# Altium project 3.NEMA_RIIM.PrjPcb
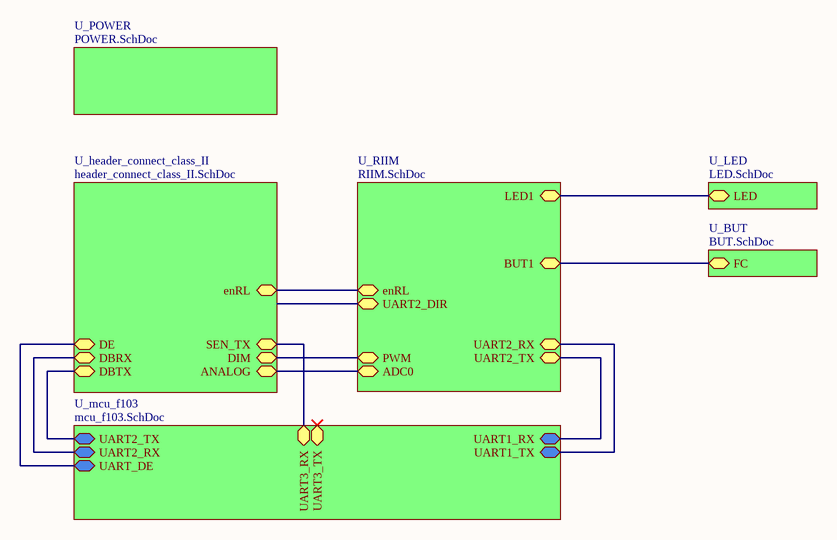
[diagram p0: Diagram.SchDoc]
6 sheets, 38 parts. Net scope: hierarchical (ports join the sheet entries above them; power ports are global).
Board file: NEMA_RIIM.PcbDoc
Sheets:
  Diagram.SchDoc
    U_BUT = BUT.SchDoc
    U_header_connect_class_II = header_connect_class_II.SchDoc
    U_LED = LED.SchDoc
    U_POWER = POWER.SchDoc
    U_RIIM = RIIM.SchDoc

## Sheet Diagram.SchDoc
size A4; SheetNumber: 1; SheetTotal: 7

### Sub-sheets
U_BUT = BUT.SchDoc: FC (bidir)
U_header_connect_class_II = header_connect_class_II.SchDoc: SEN_TX (bidir), DE (bidir), DBRX (bidir), DBTX (bidir), ANALOG (bidir), DIM (bidir), enRL (bidir)
U_LED = LED.SchDoc: LED (bidir)
U_mcu_f103 = mcu_f103.SchDoc (file not in this document): UART2_TX (bidir), UART2_RX (bidir), UART1_RX (bidir), UART1_TX (bidir), UART_DE (bidir), UART3_TX (bidir), UART3_RX (bidir)
U_POWER = POWER.SchDoc: no entries
U_RIIM = RIIM.SchDoc: LED1 (bidir), BUT1 (bidir), PWM (bidir), UART2_TX (bidir), UART2_RX (bidir), UART2_DIR (bidir), ADC0 (bidir), enRL (bidir)

### Nets
ADC0: sheet U_header_connect_class_II/ANALOG, sheet U_RIIM/ADC0
BUT1: sheet U_BUT/FC, sheet U_RIIM/BUT1
DBRX: sheet U_header_connect_class_II/DBRX, sheet U_mcu_f103/UART2_RX
DBTX: sheet U_header_connect_class_II/DBTX, sheet U_mcu_f103/UART2_TX
DE: sheet U_header_connect_class_II/DE, sheet U_mcu_f103/UART_DE
DIM: sheet U_header_connect_class_II/DIM, sheet U_RIIM/PWM
enRL: sheet U_header_connect_class_II/enRL, sheet U_RIIM/enRL
LED: sheet U_LED/LED, sheet U_RIIM/LED1
SEN_TX: sheet U_header_connect_class_II/SEN_TX, sheet U_mcu_f103/UART3_RX
UART2_RX: sheet U_RIIM/UART2_RX, sheet U_mcu_f103/UART1_TX
UART2_TX: sheet U_RIIM/UART2_TX, sheet U_mcu_f103/UART1_RX

## Sheet BUT.SchDoc
size A; SheetNumber: 6; SheetTotal: 6
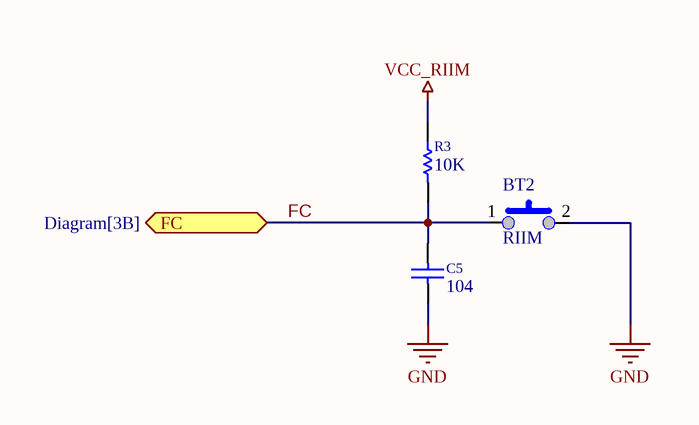
[diagram p1: BUT.SchDoc]

### Parts
BT2  RIIM  [B3U-1000P]
C5  104  [C2012-0805]
R3  10K  [R2012-0805]

### Ports
FC (bidir, see Diagram[3B])

### Nets
GND: BT2.2 C5.2
VCC_RIIM: R3.1
FC: BT2.1 C5.1 R3.2 ; port FC  [project net BUT1]

### Library data of the parts
BT2 = Button_2p
C5 = Cap <SMD>: Capacitor; AEMS Code: 2100341; Vendor: Digikey; Volt: 16V; Published: 13-April-2009; Publisher: Hoang Nguyen; ComponentLink1Description: Digikey Part Link; ComponentLink2Description: Open Datasheet; ComponentLink2URL: H:\LIBRARY\LIBRARY.Datasheet\; Value: 104
R3 = Resistor <SMD>: Resistor; AEMS Code: 1200430; Vendor: Digikey; Tollerance: 5%; Published: 17-3-2009; Publisher: Hoang Nguyen; ComponentLink1Description: Digikey Part Link; ComponentLink2Description: Open Datasheet; ComponentLink2URL: H:\LIBRARY\LIBRARY.Datasheet\; Value: 10K

## Sheet header_connect_class_II.SchDoc
size A4; SheetNumber: 2; SheetTotal: 6
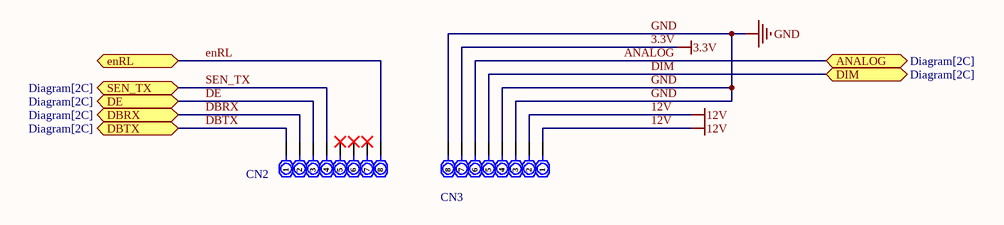
[diagram p2: header_connect_class_II.SchDoc]

### Parts
CN2  LEFT  [CON.HDR1X8]  (value not drawn)
CN3  RIGHT  [CON.HDR1X8]  (value not drawn)

### Ports
ANALOG (bidir, see Diagram[2C]), DBRX (bidir, see Diagram[2C]), DBTX (bidir, see Diagram[2C]), DE (bidir, see Diagram[2C]), DIM (bidir, see Diagram[2C]), enRL (bidir), SEN_TX (bidir, see Diagram[2C])

### Nets
3.3V: CN3.7
12V: CN3.1 CN3.2
GND: CN3.3 CN3.4 CN3.8
ANALOG: CN3.6 ; port ANALOG  [project net ADC0]
DBRX: CN2.2 ; port DBRX
DBTX: CN2.1 ; port DBTX
DE: CN2.3 ; port DE
DIM: CN3.5 ; port DIM
enRL: CN2.8 ; port enRL
SEN_TX: CN2.4 ; port SEN_TX

Not connected (* = marked no-connect by the designer): CN2 5* 6* 7*

### Library data of the parts
CN2 CN3 = CON.HDR1x8: Header 1x5; Publisher: Hoang Nguyen; ComponentLink1Description: Digikey Part link; ComponentLink2Description: Open DataSheet; ComponentLink2URL: H:\LIBRARY\LIBRARY.Datasheet\

## Sheet LED.SchDoc
size A4; SheetNumber: 2; SheetTotal: 4
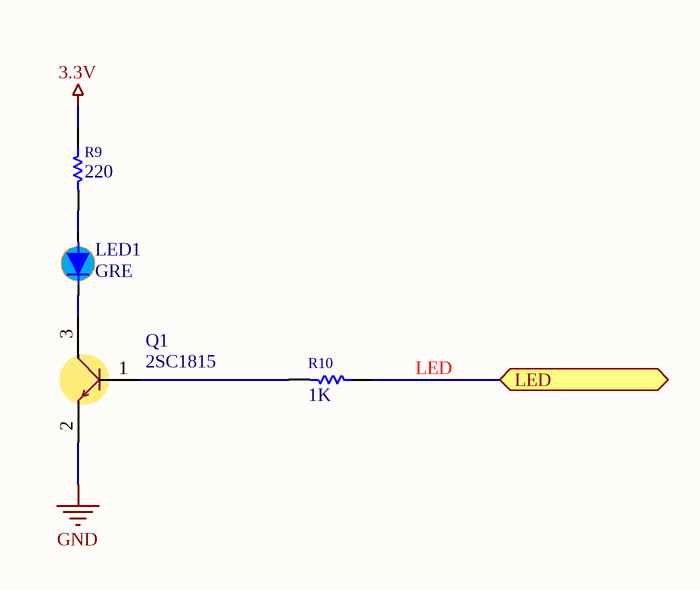
[diagram p3: LED.SchDoc]

### Parts
LED1  GRE  [Led 3mm_D]
Q1  2SC1815  [SOT23]
R9  220  [R2012-0805]
R10  1K  [R2012-0805]

### Ports
LED (bidir)

### Nets
3.3V: R9.1
GND: Q1.2(E)
LED: R10.1 ; port LED
NetLED1_1: LED1.1(A) R9.2
NetLED1_2: LED1.2(K) Q1.3(C)
NetQ1_1: Q1.1(B) R10.2

### Library data of the parts
LED1 = Led
Q1 = NPN_SMD: SMD TRANSISTOR
R9 R10 = Resistor <SMD>: as R3 on sheet BUT; Published: 17-3-2009; Publisher: Hoang Nguyen; ComponentLink1Description: Digikey Part Link; ComponentLink2Description: Open Datasheet; ComponentLink2URL: H:\LIBRARY\LIBRARY.Datasheet\
  R9: Value: 220
  R10: Value: 1K

## Sheet POWER.SchDoc
size A4; SheetNumber: 3; SheetTotal: 5
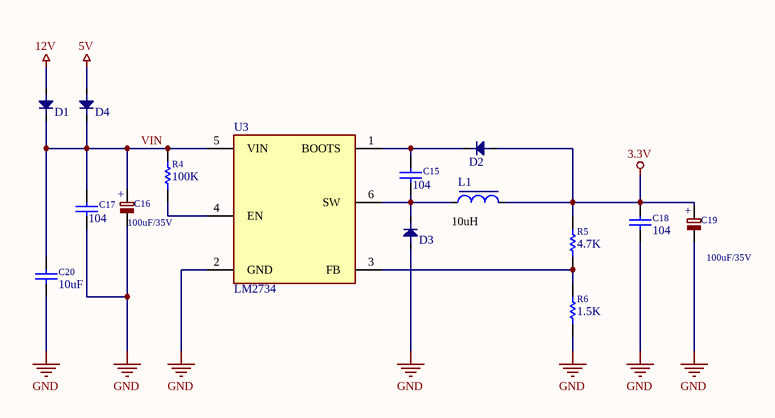
[diagram p4: POWER.SchDoc]

### Parts
C15  104  [C2012-0805]
C16  100uF/35V  [CAP_100/35V]
C17  104  [C2012-0805]
C18  104  [C2012-0805]
C19  100uF/35V  [CAP_100/35V]
C20  10uF  [C1210]
D1  SS34  [DO-214AC,SMA]  (value not drawn)
D2  SS34  [DO-214AC,SMA]  (value not drawn)
D3  SS34  [DO-214AC,SMA]  (value not drawn)
D4  SS34  [DO-214AC,SMA]  (value not drawn)
L1  10uH  [L-6030]
R4  value 100K  [R2012-0805]  (hidden comment: 4.7K)
R5  4.7K  [R2012-0805]
R6  1.5K  [R2012-0805]
U3  LM2734  [SOT23-6]

### Nets
3.3V: C18.1 C19.1(+) D2.1(A) L1.2 R5.2
5V: D4.1(A)
12V: D1.1(A)
GND: C16.2(-) C17.2 C18.2 C19.2(-) C20.2 D3.1(A) R6.1 U3.2(GND)
VIN: C16.1(+) C17.1 C20.1 D1.2(K) D4.2(K) R4.2 U3.5(VIN)
NetC15_1: C15.1 D2.2(K) U3.1(BOOTS)
NetC15_2: C15.2 D3.2(K) L1.1 U3.6(SW)
NetR4_1: R4.1 U3.4(EN)
NetR5_1: R5.1 R6.2 U3.3(FB)

### Library data of the parts
C15 C17 C18 C20 = Cap <SMD>: as C5 on sheet BUT; Published: 13-April-2009; Publisher: Hoang Nguyen; ComponentLink1Description: Digikey Part Link; ComponentLink2Description: Open Datasheet; ComponentLink2URL: H:\LIBRARY\LIBRARY.Datasheet\
  C15 C17 C18: Value: 104
  C20: Value: 10uF
C16 C19 = Cap_Pol <DIP>: Polarized Capacitor; Manufacturer: FARNELL; AEMS Code: 2100110; Vendor: Digikey; Capacitor Type: Cap Pol Dip; Published: 13-April-2009; Publisher: Hoang Nguyen; ComponentLink1Description: Digikey Part Link; ComponentLink2Description: Open Datasheet; ComponentLink2URL: H:\LIBRARY\LIBRARY.Datasheet\
D1-D4 = Didode_Smd: Vendor: Digikey; Value: FR307; Current: 3Amp; Published: 8-Jun-2000; LatestRevisionDate: 17-Jul-2002; LatestRevisionNote: Re-released for DXP Platform.; DatasheetDocument: 1997; PackageReference: DO-35; Publisher: Altium Limited; Code_JEDEC: DO-204-AH; ComponentLink1Description: Digikey Part Link; ComponentLink1URL: http://www.fairchildsemi.com/; ComponentLink2Description: Open Datasheet; ComponentLink2URL: H:\LIBRARY\LIBRARY.Datasheet\ds26003.pdf
L1 = Inductor Ferrite: Smd Inductors; Code_IEC: 1005; Vendor: Digikey; Published: 8-Jun-2000; LatestRevisionDate: 17-Jul-2002; LatestRevisionNote: Re-released for DXP Platform.; PackageReference: 0402-A; Publisher: Altium Limited; Code_JEITA: 0402; ComponentLink1Description: Digikey Part Link; ComponentLink2Description: Open Datasheet; ComponentLink2URL: H:\LIBRARY\LIBRARY.Datasheet\; Value: 10uH
R4-R6 = Resistor <SMD>: as R3 on sheet BUT; Published: 17-3-2009; Publisher: Hoang Nguyen; ComponentLink1Description: Digikey Part Link; ComponentLink2Description: Open Datasheet; ComponentLink2URL: H:\LIBRARY\LIBRARY.Datasheet\
  R5: Value: 4.7K
  R6: Value: 1.5K
U3 = LM2734: Step-Down DC-DC Regulator

## Sheet RIIM.SchDoc
size A4; SheetNumber: 5; SheetTotal: 7
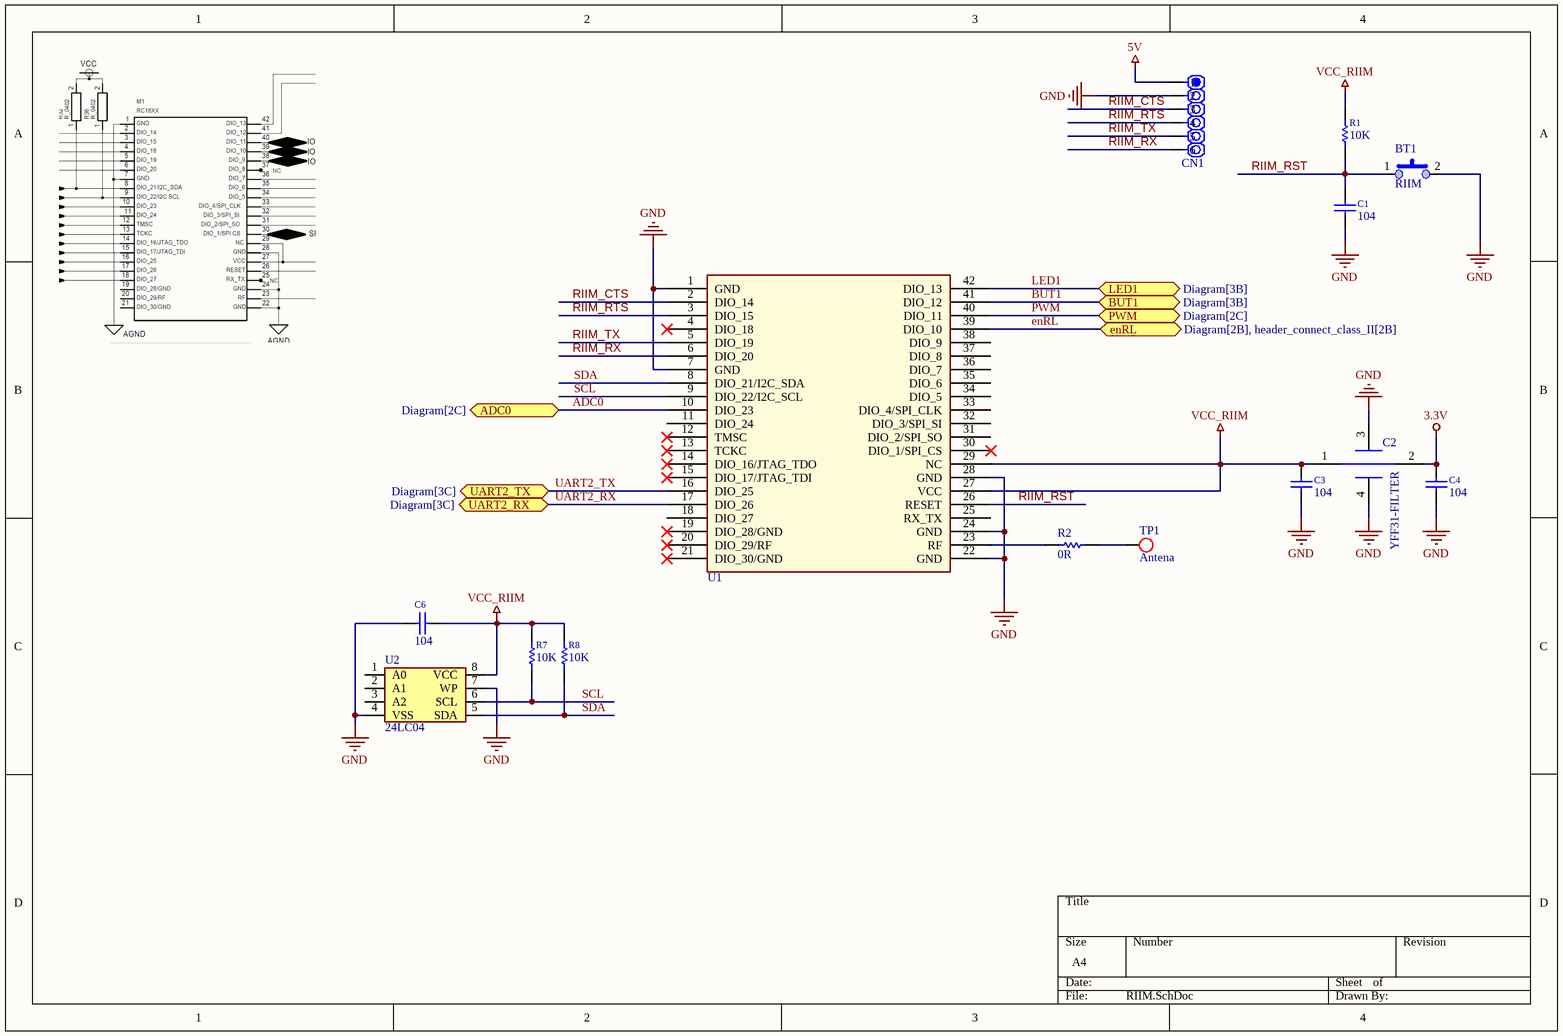
[diagram p5: RIIM.SchDoc]

### Parts
BT1  RIIM  [B3U-1000P]
C1  104  [C2012-0805]
C2  YFF31-FILTER  [YFF31PC]
C3  104  [C2012-0805]
C4  104  [C2012-0805]
C6  104  [C2012-0805]
CN1  RIIM  [CON.HD1X6H]  (value not drawn)
R1  10K  [R2012-0805]
R2  0R  [R2012-0805]
R7  10K  [R2012-0805]
R8  10K  [R2012-0805]
TP1  Antena  [TPoint]
U1  RIIM_RC_1882  [RIIM_RC1882]  (value not drawn)
U2  24LC04  [SOIC8]

### Ports
ADC0 (bidir, see Diagram[2C]), BUT1 (bidir, see Diagram[3B]), enRL (bidir, see Diagram[2B], header_connect_class_II[2B]), LED1 (bidir, see Diagram[3B]), PWM (bidir, see Diagram[2C]), UART2_RX (bidir, see Diagram[3C]), UART2_TX (bidir, see Diagram[3C])

### Nets
3.3V: C2.2(IN/OUT) C4.1
5V: CN1.1
GND: BT1.2 C1.2 C2.3(GND) C2.4(GND) C3.2 C4.2 C6.1 CN1.2 U1.1(GND) U1.7(GND) U1.22(GND) U1.24(GND) U1.28(GND) U2.4(VSS) U2.7(WP)
VCC_RIIM: C2.1(IN/OUT) C3.1 C6.2 R1.1 R7.1 R8.1 U1.27(VCC) U1.29(NC) U2.8(VCC)
ADC0: U1.10(DIO_23) ; port ADC0
BUT1: U1.41(DIO_12) ; port BUT1
enRL: U1.39(DIO_10) ; port enRL
LED1: U1.42(DIO_13) ; port LED1  [project net LED]
PWM: U1.40(DIO_11) ; port PWM  [project net DIM]
RIIM_CTS: CN1.3 U1.2(DIO_14)
RIIM_RST: BT1.1 C1.1 R1.2 U1.26(RESET)
RIIM_RTS: CN1.4 U1.3(DIO_15)
RIIM_RX: CN1.6 U1.6(DIO_20)
RIIM_TX: CN1.5 U1.5(DIO_19)
SCL: R7.2 U1.9(DIO_22/I2C_SCL) U2.6(SCL)
SDA: R8.2 U1.8(DIO_21/I2C_SDA) U2.5(SDA)
UART2_RX: U1.17(DIO_26) ; port UART2_RX
UART2_TX: U1.16(DIO_25) ; port UART2_TX
NetR2_1: R2.1 TP1.1
NetR2_2: R2.2 U1.23(RF)

Not connected (* = marked no-connect by the designer): U1 4(DIO_18)* 11(DIO_24) 12(TMSC)* 13(TCKC)* 14(DIO_16/JTAG_TDO)* 15(DIO_17/JTAG_TDI)* 18(DIO_27) 19(DIO_28/GND)* 20(DIO_29/RF)* 21(DIO_30/GND)* 25(RX_TX) 30(DIO_1/SPI_CS)* 31(DIO_2/SPI_SO) 32(DIO_3/SPI_SI) 33(DIO_4/SPI_CLK) 34(DIO_5) 35(DIO_6) 36(DIO_7) 37(DIO_8) 38(DIO_9); U2 1(A0) 2(A1) 3(A2)

### Library data of the parts
BT1 = Button_2p
C1 C3 C4 C6 = Cap <SMD>: as C5 on sheet BUT; Published: 13-April-2009; Publisher: Hoang Nguyen; ComponentLink1Description: Digikey Part Link; ComponentLink2Description: Open Datasheet; ComponentLink2URL: H:\LIBRARY\LIBRARY.Datasheet\; Value: 104
CN1 = CON.HDR1x6: Header 1x5; Publisher: Hoang Nguyen; ComponentLink1Description: Digikey Part link; ComponentLink2Description: Open DataSheet; ComponentLink2URL: H:\LIBRARY\LIBRARY.Datasheet\
R1 R7 R8 = Resistor <SMD>: as R3 on sheet BUT; Published: 17-3-2009; Publisher: Hoang Nguyen; ComponentLink1Description: Digikey Part Link; ComponentLink2Description: Open Datasheet; ComponentLink2URL: H:\LIBRARY\LIBRARY.Datasheet\; Value: 10K
R2 = RES 1/4
TP1 = TestPoint
U1 = RIIM_RC_1882: Manufacturer: Radiocrafts; Manufacturer Part Number: RC1882HPCF-IPM; Supplier 1: Digi-Key; RoHS: No; Stock 1: 842; Pricing 1: 1=24.69000, 10=22.78800, 25=20.88880, 100=19.30650, 250=18.99000 (USD); Supplier Part Number 1: 1783-RC1882HPCF-IPMCT-ND
U2 = 24LC512

## Nets that join several sheets
3.3V: header_connect_class_II (CN3.7), LED (R9.1), POWER (5 pins), RIIM (C2.2 C4.1)
5V: POWER (D4.1), RIIM (CN1.1)
12V: header_connect_class_II (CN3.1 CN3.2), POWER (D1.1)
GND: BUT (BT2.2 C5.2), header_connect_class_II (CN3.3 CN3.4 CN3.8), LED (Q1.2), POWER (8 pins), RIIM (15 pins)
VCC_RIIM: BUT (R3.1), RIIM (9 pins)
ADC0: header_connect_class_II (CN3.6), RIIM (U1.10)
BUT1: BUT (BT2.1 C5.1 R3.2), RIIM (U1.41)
DIM: header_connect_class_II (CN3.5), RIIM (U1.40)
enRL: header_connect_class_II (CN2.8), RIIM (U1.39)
LED: LED (R10.1), RIIM (U1.42)